# EAGLE design ProTrinket doubleHPdisplay (EAGLE 6.4)
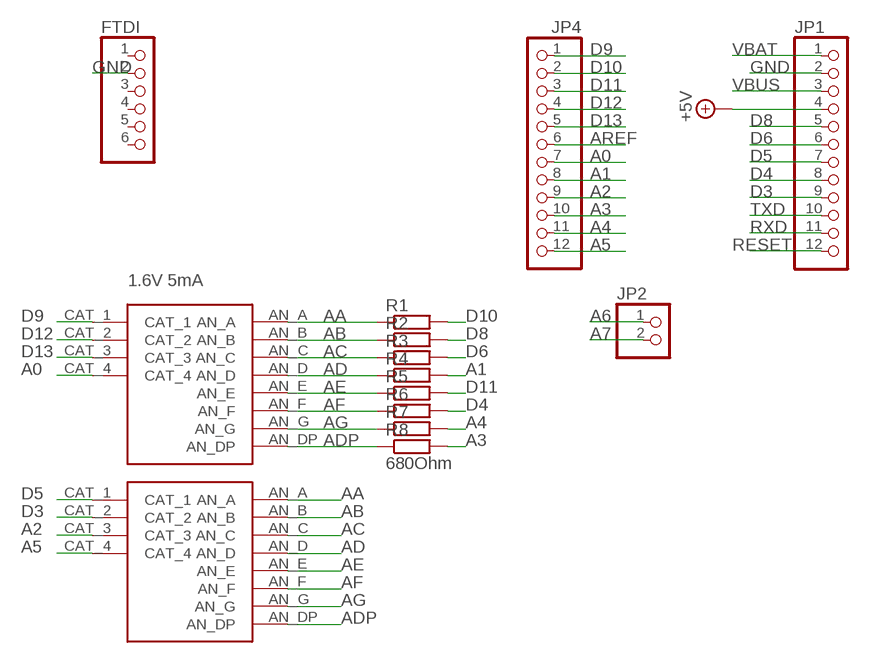
[diagram p0: schematic, sheet 1]

## Parts
FTDI  PINHD-1X6CB  [1X06-CLEANBIG]
JP1  PINHD-1X12-CB  [1X12-CB]
JP2  HEADER-1X2ROUND  [1X02_ROUND]
JP4  PINHD-1X12-CB  [1X12-CB]
R1  R-EU_R0603  [R0603]
R2  R-EU_R0603  [R0603]
R3  R-EU_R0603  [R0603]
R4  R-EU_R0603  [R0603]
R5  R-EU_R0603  [R0603]
R6  R-EU_R0603  [R0603]
R7  R-EU_R0603  [R0603]
R8  680Ohm  R-EU_R0603  [R0603]
U$1  QDSP-6064  [QDSP-6064]
U$2  QDSP-6064  [QDSP-6064]

## Nets
+5V: JP1.4
A0: JP4.7 U$1.CAT_4
A1: JP4.8 R4.2
A2: JP4.9 U$2.CAT_3
A3: JP4.10 R8.2
A4: JP4.11 R7.2
A5: JP4.12 U$2.CAT_4
A6: JP2.1
A7: JP2.2
AA: R1.1 U$1.AN_A U$2.AN_A
AB: R2.1 U$1.AN_B U$2.AN_B
AC: R3.1 U$1.AN_C U$2.AN_C
AD: R4.1 U$1.AN_D U$2.AN_D
ADP: R8.1 U$1.AN_DP U$2.AN_DP
AE: R5.1 U$1.AN_E U$2.AN_E
AF: R6.1 U$1.AN_F U$2.AN_F
AG: R7.1 U$1.AN_G U$2.AN_G
AREF: JP4.6
D3: JP1.9 U$2.CAT_2
D4: JP1.8 R6.2
D5: JP1.7 U$2.CAT_1
D6: JP1.6 R3.2
D8: JP1.5 R2.2
D9: JP4.1 U$1.CAT_1
D10: JP4.2 R1.2
D11: JP4.3 R5.2
D12: JP4.4 U$1.CAT_2
D13: JP4.5 U$1.CAT_3
GND [power]: FTDI.2 JP1.2
RESET: JP1.12
RXD: JP1.11
TXD: JP1.10
VBAT [power]: JP1.1
VBUS [power]: JP1.3
Unconnected: FTDI.1 FTDI.3 FTDI.4 FTDI.5 FTDI.6

## Notes on the sheet
- 1.6V 5mA

## Library data of the parts
FTDI = adafruit:PINHD-1X6: PIN HEADER
JP1 JP4 = adafruit:PINHD-1X12: PIN HEADER
JP2 = microbuilder:HEADER-1X2: PIN HEADER
R1-R8 = rcl:R-EU_: RESISTOR, European symbol
U$1 U$2 = QDSP-6064:QDSP-6064

## Net classes
1 power: width 0.305 mm

## Board
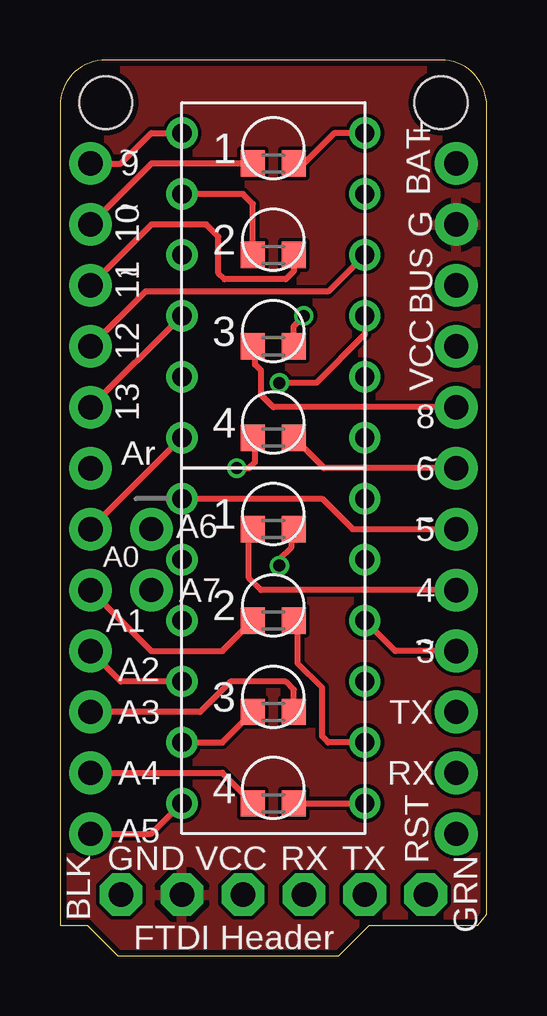
[diagram p1: board, top side]
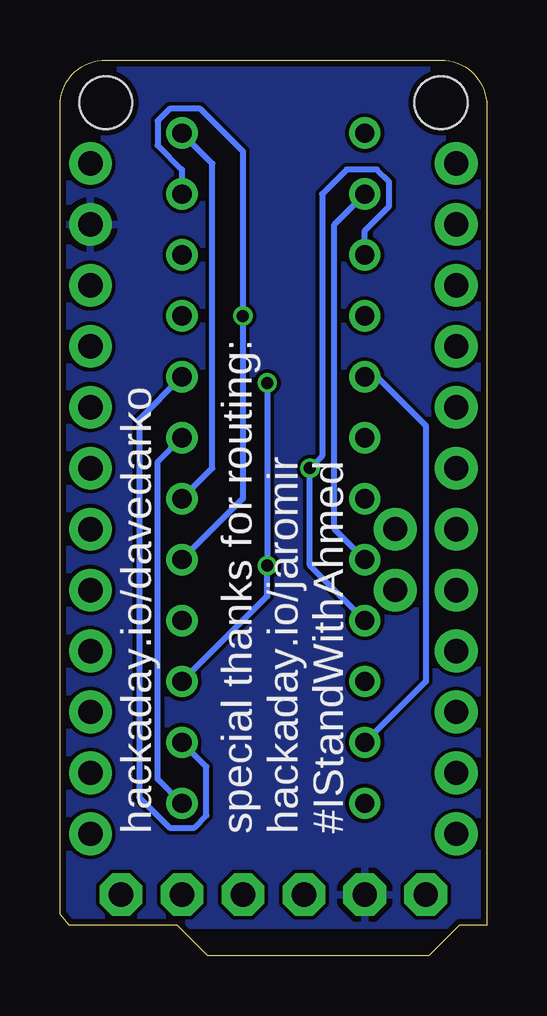
[diagram p2: board, bottom side, seen from below]

Size 17.78 x 37.34 mm. Coordinates in mm from the lower left corner, seen from the top.
Outline: 17.78,1.71 17.78,35.43 arc90 15.88,37.34 1.9,37.34 arc90 0,35.43 0,1.27 1.14,1.27 2.41,0 11.62,0 12.89,1.27 17.4,1.27 17.78,1.71
Copper layers (1*16): Top 0.035mm / dielectric 1.5mm / Bottom 0.035mm
Design rules "Fusion_eagle_rule_v1.1": minimum track width 6mil, minimum drill 0.3mm, track to track 6mil, track to pad 6mil, pad to pad 6mil, via to via 6mil, smd to smd 0mil, copper to edge 10mil, drill to drill 10mil, minimum pad ring 10mil, minimum via ring 6mil, stop-mask expansion 2mil, vias tented up to drill 100mil, thermal gap 10mil
Holes 2.2 mm at 1.9,35.56 15.88,35.56

### Footprints (pad centres in the part's own frame; a part is rotated, then mirrored left to right if it is on the bottom)
1X06-CLEANBIG = drill 1.016 pad 1.778 octagon: 1 -6.35,0; 2 -3.81,0; 3 -1.27,0; 4 1.27,0; 5 3.81,0; 6 6.35,0
1X12-CB = drill 1.016 pad 1.778: 1 -13.97,0; 2 -11.43,0; 3 -8.89,0; 4 -6.35,0; 5 -3.81,0; 6 -1.27,0; 7 1.27,0; 8 3.81,0; 9 6.35,0; 10 8.89,0; 11 11.43,0; 12 13.97,0
1X02_ROUND = drill 1 pad 1.778: 1 -1.27,0; 2 1.27,0
R0603 = smd 1 x 1.1: 1 -0.85,0; 2 0.85,0
QDSP-6064 = drill 0.8: AN_A 3.81,6.35; AN_B 3.81,3.81; AN_C -3.81,1.27; AN_D 3.81,-3.81; AN_DP -3.81,-3.81; AN_E -3.81,3.81; AN_F 3.81,-1.27; AN_G 3.81,-6.35; CAT_1 -3.81,6.35; CAT_2 3.81,1.27; CAT_3 -3.81,-1.27; CAT_4 -3.81,-6.35

### Placement (x,y rotation side)
FTDI  8.89,2.54 0 top
JP1  16.51,19.05 270 top
JP2  3.81,16.51 270 top
JP4  1.27,19.05 270 top
R1  8.89,33.02 180 top
R2  8.89,25.4 180 top
R3  8.89,21.59 0 top
R4  8.89,13.97 180 top
R5  8.89,29.21 0 top
R6  8.89,17.78 180 top
R7  8.89,6.35 180 top
R8  8.89,10.16 0 top
U$1  8.89,27.94 0 top
U$2  8.89,12.7 0 top

### Tracks (layer width: path | path; a pad name or v marks a point on that pad's centre or on a via)
A0
  Top 0.254: JP4.7 U$1.CAT_4
A1
  Top 0.254: JP4.8 3.81,12.7 6.77,12.7 R4.2
A2
  Top 0.254: U$2.CAT_3 2.54,11.43 JP4.9
A3
  Top 0.254: R8.2 9.74,11.09 9.4,11.43 7.11,11.43 5.84,10.16 JP4.10
A4
  Top 0.254: JP4.11 6.77,7.62 R7.2
A5
  Top 0.254: JP4.12 3.81,5.08 U$2.CAT_4
AA
  Top 0.254: U$1.AN_A 11.43,34.29 10.16,33.02 R1.1
  Bottom 0.254: U$2.AN_A 11.43,20.32 11.43,33.02 U$1.AN_A
AB  (via drill 0.5)
  Top 0.254: R2.1 9.74,26.25 v10.16,26.67
  Bottom 0.254: U$2.AN_B 10.16,19.05 v10.16,26.67 10.16,33.53 11.94,35.31 13.21,35.31 13.72,34.8 13.72,33.78 12.7,32.77 U$1.AN_B
AC  (via drill 0.5)
  Top 0.254: v7.37,20.32 7.87,20.32 8.13,20.57 8.13,21.5 R3.1
  Bottom 0.254: U$2.AN_C 7.37,16.26 v7.37,20.32 6.86,20.83 6.86,31.75 5.84,32.77 4.57,32.77 4.06,32.26 4.06,31.24 5.08,30.23 U$1.AN_C
AD
  Top 0.254: U$2.AN_D 11.18,8.89 10.92,9.14 10.92,11.18 9.91,12.19 9.91,13.8 R4.1
  Bottom 0.254: U$1.AN_D 14.48,22.35 14.48,6.6 13.21,5.33 12.19,5.33 11.68,5.84 11.68,7.87 U$2.AN_D
ADP
  Top 0.254: U$2.AN_DP 6.77,8.89 R8.1
  Bottom 0.254: U$1.AN_DP 4.57,24.13 2.54,22.1 2.54,11.43 U$2.AN_DP
AE
  Top 0.254: R5.1 8.04,31.33 7.62,31.75 U$1.AN_E
  Bottom 0.254: U$2.AN_E 6.35,17.78 6.35,30.48 U$1.AN_E
AF  (via drill 0.5)
  Top 0.254: v9.14,16.26 9.14,16.51 9.65,17.02 9.65,17.69 R6.1 | U$1.AN_F 12.7,25.91 10.67,23.88 v9.14,23.88
  Bottom 0.254: U$2.AN_F 9.14,14.99 v9.14,16.26 v9.14,23.88
AG
  Top 0.254: R7.1 U$2.AN_G
  Bottom 0.254: U$2.AN_G 13.72,7.37 13.72,20.57 U$1.AN_G
D3
  Top 0.254: JP1.9 13.97,12.7 U$2.CAT_2
D4
  Top 0.254: JP1.8 8.38,15.24 7.87,15.75 7.87,17.61 R6.2
D5
  Top 0.254: U$2.CAT_1 10.92,19.05 12.19,17.78 JP1.7
D6
  Top 0.254: JP1.6 11.01,20.32 R3.2
D8
  Top 0.254: JP1.5 8.89,22.86 8.38,23.37 8.38,24.38 8.13,24.64 8.13,25.31 R2.2
D9
  Top 0.254: JP4.1 2.54,33.02 3.81,34.29 U$1.CAT_1
D10
  Top 0.254: R1.2 3.81,33.02 JP4.2
D11
  Top 0.254: R5.2 9.74,28.54 9.4,28.19 6.86,28.19 6.6,28.45 6.6,29.97 6.1,30.48 3.81,30.48 JP4.3
D12
  Top 0.254: U$1.CAT_2 11.18,27.69 3.56,27.69 JP4.4
D13
  Top 0.254: JP4.5 U$1.CAT_3
GND
  pour Bottom: 0,38.1 0,1.27 17.78,1.27 17.78,38.1
  pour Top: -1.65,40.64 18.67,40.64 18.67,-2.54 -1.65,-2.54

### Text on the board
tPlace: ~ | + | 9 | BAT | ~ | G | 10 | BUS | 11 | ~ | VCC | 12 | 13 | 8 | Ar | ~ | 6 | A6 | 5 | ~ | A0 | A7 | 4 | A1 | 3 | ~ | A2 | A3 | TX | A4 | RX | RST | A5 | BLK | GND | VCC | RX | TX | GRN | FTDI Header
bNames: #IStandWithAhmed | special thanks for routing: / hackaday.io/jaromir | hackaday.io/davedarko